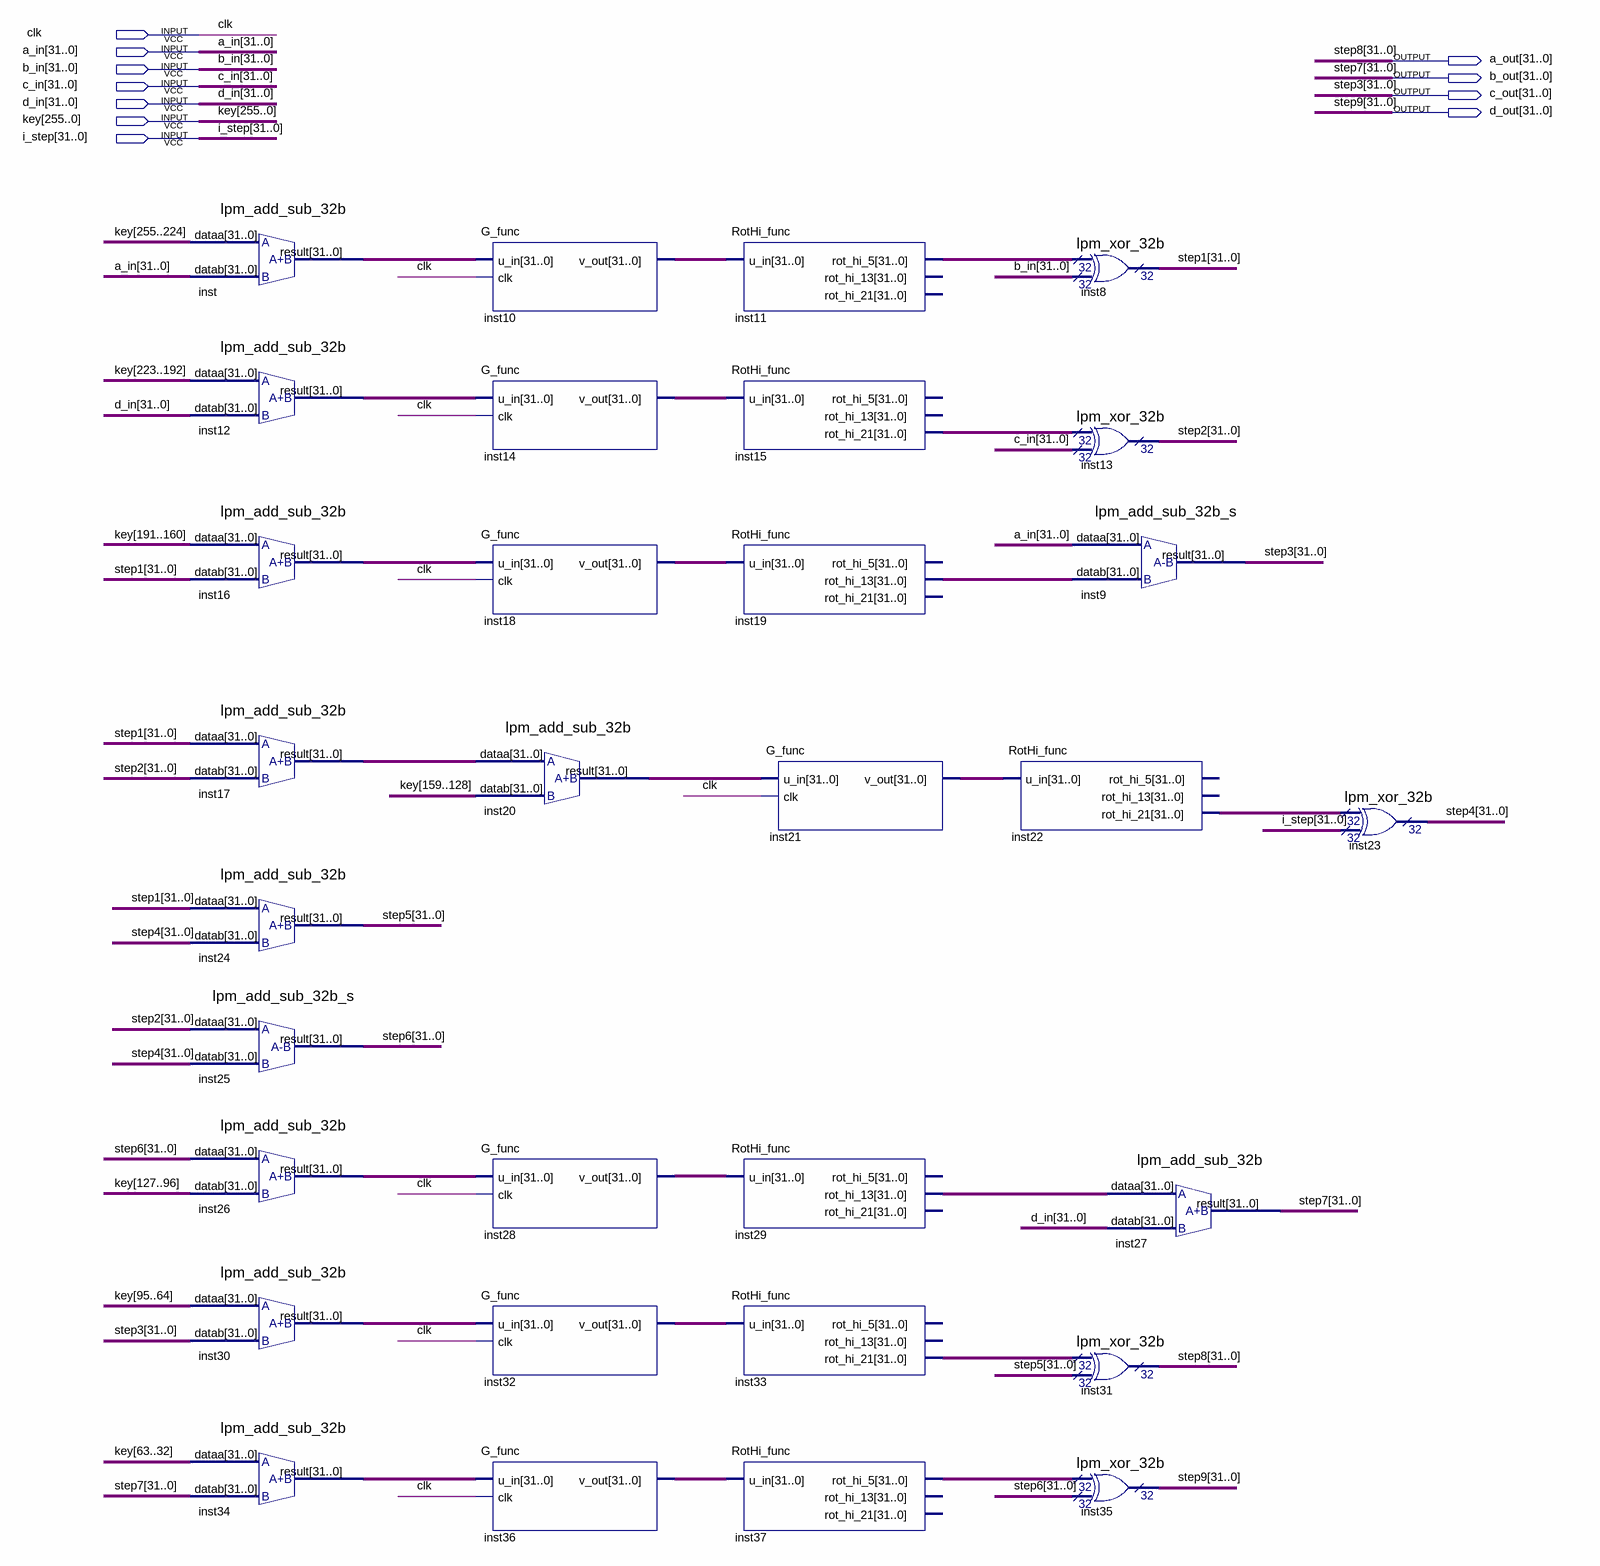
[diagram p0: schematic sheet]
// Quartus schematic Stage_block.bdf as structural Verilog: 31 symbols, 11 pins
module Stage_block (
  input  clk,
  input  [31:0] a_in,
  input  [31:0] b_in,
  input  [31:0] c_in,
  input  [31:0] d_in,
  input  [255:0] key,
  input  [31:0] i_step,
  output [31:0] a_out,
  output [31:0] b_out,
  output [31:0] c_out,
  output [31:0] d_out
);

  wire [31:0] inst10_v_out, inst11_rot_hi_5, inst12_result, inst14_v_out, inst15_rot_hi_21, inst16_result,
       inst17_result, inst18_v_out, inst19_rot_hi_13, inst20_result, inst21_v_out, inst22_rot_hi_21,
       inst26_result, inst28_v_out, inst29_rot_hi_13, inst30_result, inst32_v_out, inst33_rot_hi_21,
       inst34_result, inst36_v_out, inst37_rot_hi_5, inst_result, step1, step2, step4, step5, step6;

  lpm_add_sub_32b inst (.dataa(key[255:224]), .datab(a_in), .result(inst_result));
  lpm_add_sub_32b inst12 (.dataa(key[223:192]), .datab(d_in), .result(inst12_result));
  lpm_add_sub_32b inst16 (.dataa(key[191:160]), .datab(step1), .result(inst16_result));
  lpm_add_sub_32b inst17 (.dataa(step1), .datab(step2), .result(inst17_result));
  lpm_add_sub_32b inst24 (.dataa(step1), .datab(step4), .result(step5));
  lpm_add_sub_32b_s inst25 (.dataa(step2), .datab(step4), .result(step6));
  lpm_add_sub_32b inst26 (.dataa(step6), .datab(key[127:96]), .result(inst26_result));
  lpm_add_sub_32b inst30 (.dataa(key[95:64]), .datab(c_out), .result(inst30_result));
  lpm_add_sub_32b inst34 (.dataa(key[63:32]), .datab(b_out), .result(inst34_result));
  G_func inst10 (.u_in(inst_result), .clk(clk), .v_out(inst10_v_out));
  G_func inst14 (.u_in(inst12_result), .clk(clk), .v_out(inst14_v_out));
  G_func inst18 (.u_in(inst16_result), .clk(clk), .v_out(inst18_v_out));
  lpm_add_sub_32b inst20 (.dataa(inst17_result), .datab(key[159:128]), .result(inst20_result));
  G_func inst28 (.u_in(inst26_result), .clk(clk), .v_out(inst28_v_out));
  G_func inst32 (.u_in(inst30_result), .clk(clk), .v_out(inst32_v_out));
  G_func inst36 (.u_in(inst34_result), .clk(clk), .v_out(inst36_v_out));
  RotHi_func inst11 (.u_in(inst10_v_out), .rot_hi_5(inst11_rot_hi_5));  // open: rot_hi_13, rot_hi_21
  RotHi_func inst15 (.u_in(inst14_v_out), .rot_hi_21(inst15_rot_hi_21));  // open: rot_hi_5, rot_hi_13
  RotHi_func inst19 (.u_in(inst18_v_out), .rot_hi_13(inst19_rot_hi_13));  // open: rot_hi_5, rot_hi_21
  RotHi_func inst29 (.u_in(inst28_v_out), .rot_hi_13(inst29_rot_hi_13));  // open: rot_hi_5, rot_hi_21
  RotHi_func inst33 (.u_in(inst32_v_out), .rot_hi_21(inst33_rot_hi_21));  // open: rot_hi_5, rot_hi_13
  RotHi_func inst37 (.u_in(inst36_v_out), .rot_hi_5(inst37_rot_hi_5));  // open: rot_hi_13, rot_hi_21
  G_func inst21 (.u_in(inst20_result), .clk(clk), .v_out(inst21_v_out));
  RotHi_func inst22 (.u_in(inst21_v_out), .rot_hi_21(inst22_rot_hi_21));  // open: rot_hi_5, rot_hi_13
  lpm_xor_32b inst8 (.data0x(inst11_rot_hi_5), .data1x(b_in), .result(step1));
  lpm_xor_32b inst13 (.data0x(inst15_rot_hi_21), .data1x(c_in), .result(step2));
  lpm_add_sub_32b_s inst9 (.dataa(a_in), .datab(inst19_rot_hi_13), .result(c_out));
  lpm_xor_32b inst31 (.data0x(inst33_rot_hi_21), .data1x(step5), .result(a_out));
  lpm_xor_32b inst35 (.data0x(inst37_rot_hi_5), .data1x(step6), .result(d_out));
  lpm_add_sub_32b inst27 (.dataa(inst29_rot_hi_13), .datab(d_in), .result(b_out));
  lpm_xor_32b inst23 (.data0x(inst22_rot_hi_21), .data1x(i_step), .result(step4));

  // Other names for the same wires on the sheet: step3[31:0] = c_out; step7[31:0] = b_out; step8[31:0] = a_out;
  //   step9[31:0] = d_out
endmodule
